# Altium project WFR24_ECU_V1_loc.PrjPcb
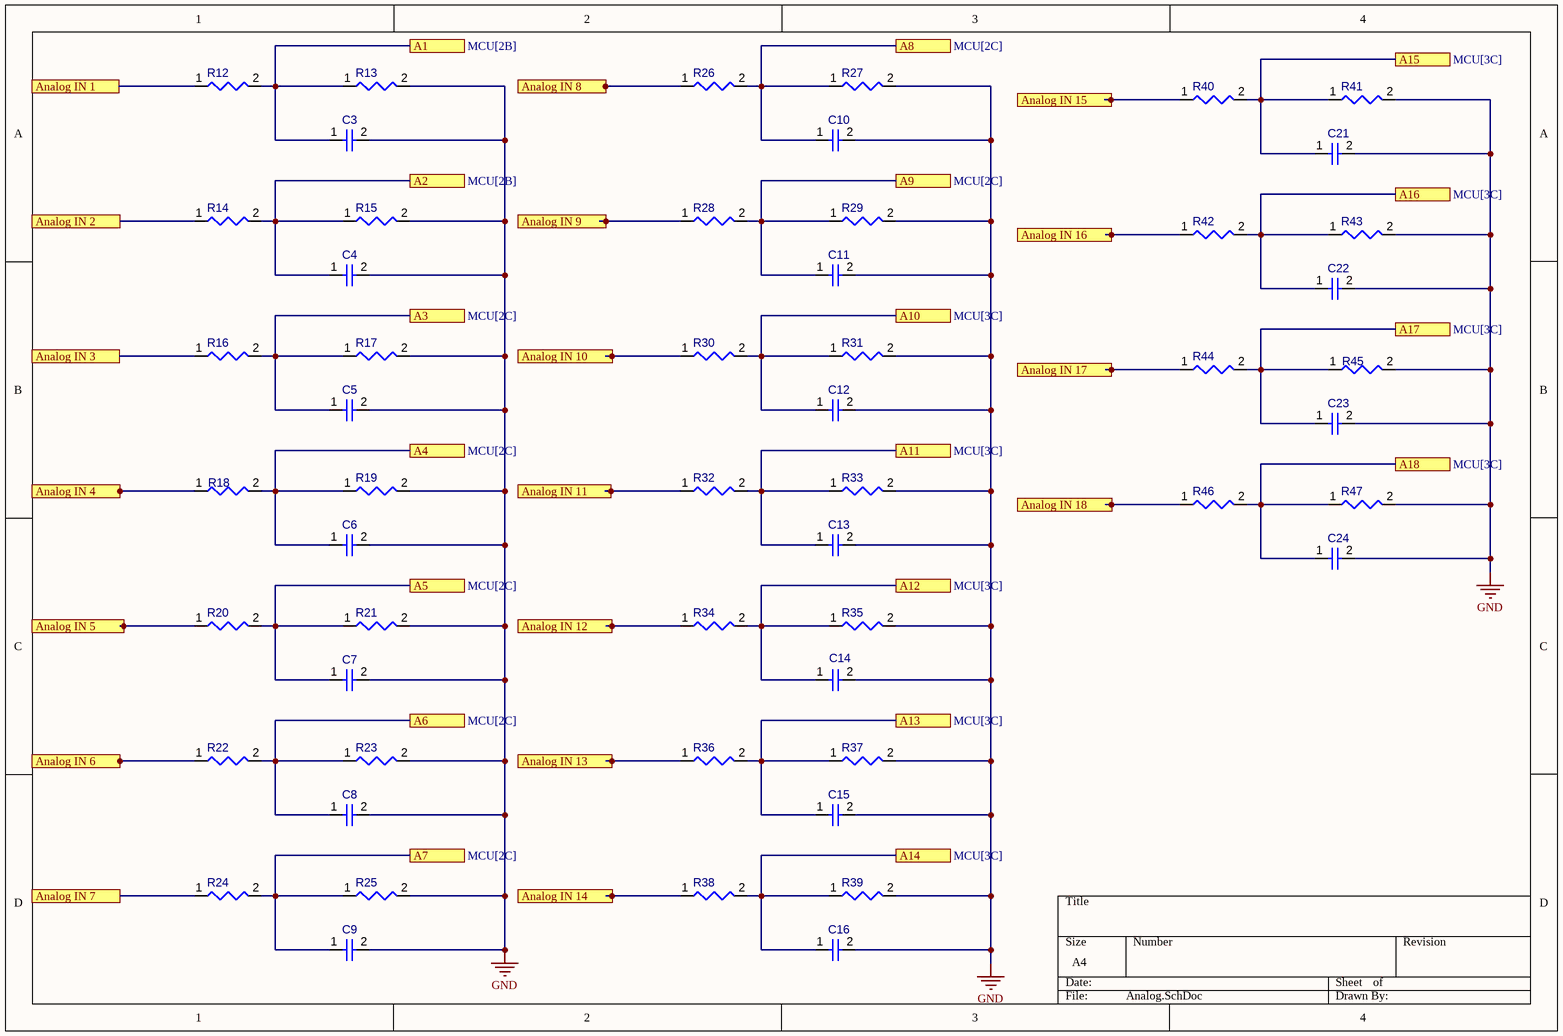
[diagram p0: Analog.SchDoc]
SCH_REV: A; PCB_REV: A; PCB_PART_NUMBER: <PCB PN>; PCB_ENGINEER_APP_DATE: --/--/----; PCB_ENGINEER: - -----; PCB_DWG_NO: <PCB DWG NO>; PCB_DESIGNER_APP_DATE: --/--/----; PCB_DESIGNER: - -----; PCB_CHECKER_APP_DATE: --/--/----; PCB_CHECKER: - -----; PCB_ASSEMBLY_NO: <PCB ASSY NO>; PCB_ANG_TOL: +/-1/2; PCB_3_DEC_TOL: +/-.010; PCB_2_DEC_TOL: +/-.01; DOC_NO_SCH_DWG: <SCH DWG NO>; DOC_NO_FAB_DWG: <FAB DWG NO>; DOC_NO_BOM: <BOM DOC NO>; DOC_NO_ASSY_DWG: <ASSY DWG NO>; CONTRACT_NUMBER: <CONTRACT NO>; CAGE_CODE: ?????
4 sheets, 94 parts. Net scope: flat (ports and power ports of the same name join across sheets).
Board file: PCB1.PcbDoc
Sheets:
  Analog.SchDoc
  DigitalandPWR.SchDoc
  Inputs.SchDoc
  MCU.SchDoc

## Sheet Analog.SchDoc
size A4; SheetNumber: 1; SheetTotal: 5

### Parts
C3  AC0402KRX7R7BB333  [CAPC1005X04N]  (value not drawn)
C4  AC0402KRX7R7BB333  [CAPC1005X04N]  (value not drawn)
C5  AC0402KRX7R7BB333  [CAPC1005X04N]  (value not drawn)
C6  AC0402KRX7R7BB333  [CAPC1005X04N]  (value not drawn)
C7  AC0402KRX7R7BB333  [CAPC1005X04N]  (value not drawn)
C8  AC0402KRX7R7BB333  [CAPC1005X04N]  (value not drawn)
C9  AC0402KRX7R7BB333  [CAPC1005X04N]  (value not drawn)
C10  AC0402KRX7R7BB333  [CAPC1005X04N]  (value not drawn)
C11  AC0402KRX7R7BB333  [CAPC1005X04N]  (value not drawn)
C12  AC0402KRX7R7BB333  [CAPC1005X04N]  (value not drawn)
C13  AC0402KRX7R7BB333  [CAPC1005X04N]  (value not drawn)
C14  AC0402KRX7R7BB333  [CAPC1005X04N]  (value not drawn)
C15  AC0402KRX7R7BB333  [CAPC1005X04N]  (value not drawn)
C16  AC0402KRX7R7BB333  [CAPC1005X04N]  (value not drawn)
C21  AC0402KRX7R7BB333  [CAPC1005X04N]  (value not drawn)
C22  AC0402KRX7R7BB333  [CAPC1005X04N]  (value not drawn)
C23  AC0402KRX7R7BB333  [CAPC1005X04N]  (value not drawn)
C24  AC0402KRX7R7BB333  [CAPC1005X04N]  (value not drawn)
R12  0402WGD2002TCE  [CAPC1005X04N]  (value not drawn)
R13  SY0402DE30KP  [CAPC1005X04N]  (value not drawn)
R14  0402WGD2002TCE  [CAPC1005X04N]  (value not drawn)
R15  SY0402DE30KP  [CAPC1005X04N]  (value not drawn)
R16  0402WGD2002TCE  [CAPC1005X04N]  (value not drawn)
R17  SY0402DE30KP  [CAPC1005X04N]  (value not drawn)
R18  0402WGD2002TCE  [CAPC1005X04N]  (value not drawn)
R19  SY0402DE30KP  [CAPC1005X04N]  (value not drawn)
R20  0402WGD2002TCE  [CAPC1005X04N]  (value not drawn)
R21  SY0402DE30KP  [CAPC1005X04N]  (value not drawn)
R22  0402WGD2002TCE  [CAPC1005X04N]  (value not drawn)
R23  SY0402DE30KP  [CAPC1005X04N]  (value not drawn)
R24  0402WGD2002TCE  [CAPC1005X04N]  (value not drawn)
R25  SY0402DE30KP  [CAPC1005X04N]  (value not drawn)
R26  0402WGD2002TCE  [CAPC1005X04N]  (value not drawn)
R27  SY0402DE30KP  [CAPC1005X04N]  (value not drawn)
R28  0402WGD2002TCE  [CAPC1005X04N]  (value not drawn)
R29  SY0402DE30KP  [CAPC1005X04N]  (value not drawn)
R30  0402WGD2002TCE  [CAPC1005X04N]  (value not drawn)
R31  SY0402DE30KP  [CAPC1005X04N]  (value not drawn)
R32  0402WGD2002TCE  [CAPC1005X04N]  (value not drawn)
R33  SY0402DE30KP  [CAPC1005X04N]  (value not drawn)
R34  0402WGD2002TCE  [CAPC1005X04N]  (value not drawn)
R35  SY0402DE30KP  [CAPC1005X04N]  (value not drawn)
R36  0402WGD2002TCE  [CAPC1005X04N]  (value not drawn)
R37  SY0402DE30KP  [CAPC1005X04N]  (value not drawn)
R38  0402WGD2002TCE  [CAPC1005X04N]  (value not drawn)
R39  SY0402DE30KP  [CAPC1005X04N]  (value not drawn)
R40  0402WGD2002TCE  [CAPC1005X04N]  (value not drawn)
R41  SY0402DE30KP  [CAPC1005X04N]  (value not drawn)
R42  0402WGD2002TCE  [CAPC1005X04N]  (value not drawn)
R43  SY0402DE30KP  [CAPC1005X04N]  (value not drawn)
R44  0402WGD2002TCE  [CAPC1005X04N]  (value not drawn)
R45  SY0402DE30KP  [CAPC1005X04N]  (value not drawn)
R46  0402WGD2002TCE  [CAPC1005X04N]  (value not drawn)
R47  SY0402DE30KP  [CAPC1005X04N]  (value not drawn)

### Ports
A1 (see MCU[2B]), A2 (see MCU[2B]), A3 (see MCU[2C]), A4 (see MCU[2C]), A5 (see MCU[2C]), A6 (see MCU[2C]), A7 (see MCU[2C]), A8 (see MCU[2C]), A9 (see MCU[2C]), A10 (see MCU[3C]), A11 (see MCU[3C]), A12 (see MCU[3C]), A13 (see MCU[3C]), A14 (see MCU[3C]), A15 (see MCU[3C]), A16 (see MCU[3C]), A17 (see MCU[3C]), A18 (see MCU[3C]), Analog IN 1, Analog IN 2, Analog IN 3, Analog IN 4, Analog IN 5, Analog IN 6, Analog IN 7, Analog IN 8, Analog IN 9, Analog IN 10, Analog IN 11, Analog IN 12, Analog IN 13, Analog IN 14, Analog IN 15, Analog IN 16, Analog IN 17, Analog IN 18

### Nets
GND: C3.2 C4.2 C5.2 C6.2 C7.2 C8.2 C9.2 C10.2 C11.2 C12.2 C13.2 C14.2 C15.2 C16.2 C21.2 C22.2 C23.2 C24.2 R13.2 R15.2 R17.2 R19.2 R21.2 R23.2 R25.2 R27.2 R29.2 R31.2 R33.2 R35.2 R37.2 R39.2 R41.2 R43.2 R45.2 R47.2
A1: C3.1 R12.2 R13.1 ; port A1
A2: C4.1 R14.2 R15.1 ; port A2
A3: C5.1 R16.2 R17.1 ; port A3
A4: C6.1 R18.2 R19.1 ; port A4
A5: C7.1 R20.2 R21.1 ; port A5
A6: C8.1 R22.2 R23.1 ; port A6
A7: C9.1 R24.2 R25.1 ; port A7
A8: C10.1 R26.2 R27.1 ; port A8
A9: C11.1 R28.2 R29.1 ; port A9
A10: C12.1 R30.2 R31.1 ; port A10
A11: C13.1 R32.2 R33.1 ; port A11
A12: C14.1 R34.2 R35.1 ; port A12
A13: C15.1 R36.2 R37.1 ; port A13
A14: C16.1 R38.2 R39.1 ; port A14
A15: C21.1 R40.2 R41.1 ; port A15
A16: C22.1 R42.2 R43.1 ; port A16
A17: C23.1 R44.2 R45.1 ; port A17
A18: C24.1 R46.2 R47.1 ; port A18
Analog IN 1: R12.1 ; port Analog IN 1
Analog IN 2: R14.1 ; port Analog IN 2
Analog IN 3: R16.1 ; port Analog IN 3
Analog IN 4: R18.1 ; port Analog IN 4
Analog IN 5: R20.1 ; port Analog IN 5
Analog IN 6: R22.1 ; port Analog IN 6
Analog IN 7: R24.1 ; port Analog IN 7
Analog IN 8: R26.1 ; port Analog IN 8
Analog IN 9: R28.1 ; port Analog IN 9
Analog IN 10: R30.1 ; port Analog IN 10
Analog IN 11: R32.1 ; port Analog IN 11
Analog IN 12: R34.1 ; port Analog IN 12
Analog IN 13: R36.1 ; port Analog IN 13
Analog IN 14: R38.1 ; port Analog IN 14
Analog IN 15: R40.1 ; port Analog IN 15
Analog IN 16: R42.1 ; port Analog IN 16
Analog IN 17: R44.1 ; port Analog IN 17
Analog IN 18: R46.1 ; port Analog IN 18

### Library data of the parts
C3-C16 C21-C24 = CMP-001-00107-1: 33nF capacitor
R12 R14 = CMP-009-00205-1: 20k; Case/Package: 0402
R13 R15 R17 R19 R21 R23 R25 R27 R29 R31 R33 R35 R37 R39 R41 R43 R45 R47 = CMP-009-00206-1: 30k Resistor
R16 R18 R20 R22 R24 R26 R28 R30 R32 R34 R36 R38 R40 R42 R44 R46 = CMP-009-00205-1: Case/Package: 0402

## Sheet DigitalandPWR.SchDoc
size A4; SheetNumber: 2; SheetTotal: 3
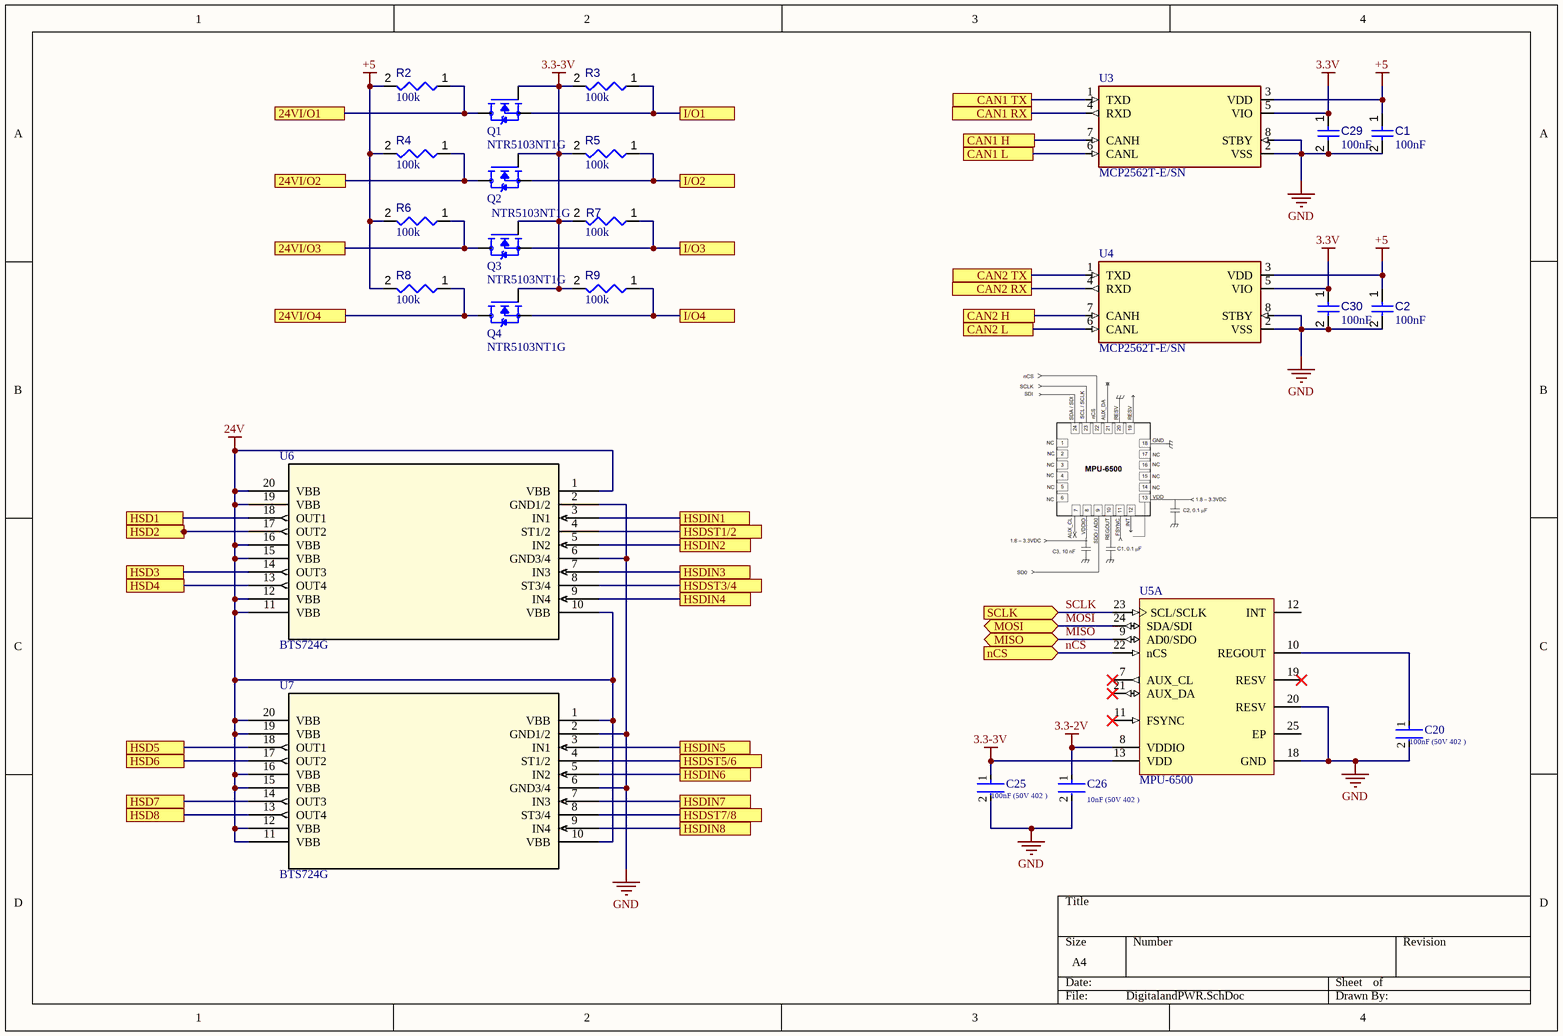
[diagram p1: DigitalandPWR.SchDoc]

### Parts
C1  value 100nF  [CAPC0402(1005)60_L]  (hidden comment: Capacitor 100nF +/-20% 25V 0402)
C2  value 100nF  [CAPC0402(1005)60_L]  (hidden comment: Capacitor 100nF +/-20% 25V 0402)
C20  100nF (50V 402 )  [FP-CL779-IPC_C]
C25  100nF (50V 402 )  [FP-CL779-IPC_C]
C26  10nF (50V 402 )  [FP-CL165-IPC_C]
C29  value 100nF  [CAPC0402(1005)60_L]  (hidden comment: Capacitor 100nF +/-20% 25V 0402)
C30  value 100nF  [CAPC0402(1005)60_L]  (hidden comment: Capacitor 100nF +/-20% 25V 0402)
Q1  NTR5103NT1G  [SOT95P237X111-3N]
Q2  NTR5103NT1G  [SOT95P237X111-3N]
Q3  NTR5103NT1G  [SOT95P237X111-3N]
Q4  NTR5103NT1G  [SOT95P237X111-3N]
R2  value 100k  [RESC0402(1005)_L]  (hidden comment: Resistor 100K +/-1 % 0402 63 mW)
R3  value 100k  [RESC0402(1005)_L]  (hidden comment: Resistor 100K +/-1 % 0402 63 mW)
R4  value 100k  [RESC0402(1005)_L]  (hidden comment: Resistor 100K +/-1 % 0402 63 mW)
R5  value 100k  [RESC0402(1005)_L]  (hidden comment: Resistor 100K +/-1 % 0402 63 mW)
R6  value 100k  [RESC0402(1005)_L]  (hidden comment: Resistor 100K +/-1 % 0402 63 mW)
R7  value 100k  [RESC0402(1005)_L]  (hidden comment: Resistor 100K +/-1 % 0402 63 mW)
R8  value 100k  [RESC0402(1005)_L]  (hidden comment: Resistor 100K +/-1 % 0402 63 mW)
R9  value 100k  [RESC0402(1005)_L]  (hidden comment: Resistor 100K +/-1 % 0402 63 mW)
U3  MCP2562T-E/SN  [SOIC127P600X175-8N]
U4  MCP2562T-E/SN  [SOIC127P600X175-8N]
U5  MPU-6500  [INSE-MPU-6500-QFN24_M]  (part A of 2)
U6  BTS724G  [SOIC-20_INF]
U7  BTS724G  [SOIC-20_INF]

### Ports
24VI/O1, 24VI/O2, 24VI/O3, 24VI/O4, CAN1 H, CAN1 L, CAN1 RX, CAN1 TX, CAN2 H, CAN2 L, CAN2 RX, CAN2 TX, HSD1, HSD2, HSD3, HSD4, HSD5, HSD6, HSD7, HSD8, HSDIN1, HSDIN2, HSDIN3, HSDIN4, HSDIN5, HSDIN6, HSDIN7, HSDIN8, HSDST1/2, HSDST3/4, HSDST5/6, HSDST7/8, I/O1, I/O2, I/O3, I/O4, MISO (bidir), MOSI (bidir), nCS (in), SCLK (in)

### Nets
3.3-2V: C26.1 U5.8(VDDIO)
3.3-3V: C25.1 Q1.1(G) Q2.1(G) Q3.1(G) Q4.1(G) R3.2 R5.2 R7.2 R9.2 U5.13(VDD)
3.3V: C29.1 C30.1 U3.5(VIO) U4.5(VIO)
24V: U6.1(VBB) U6.10(VBB) U6.11(VBB) U6.12(VBB) U6.15(VBB) U6.16(VBB) U6.19(VBB) U6.20(VBB) U7.1(VBB) U7.10(VBB) U7.11(VBB) U7.12(VBB) U7.15(VBB) U7.16(VBB) U7.19(VBB) U7.20(VBB)
+5: C1.1 C2.1 R2.2 R4.2 R6.2 R8.2 U3.3(VDD) U4.3(VDD)
GND: C1.2 C2.2 C20.2 C25.2 C26.2 C29.2 C30.2 U3.2(VSS) U3.8(STBY) U4.2(VSS) U4.8(STBY) U5.18(GND) U5.20(RESV) U6.2(GND1/2) U6.6(GND3/4) U7.2(GND1/2) U7.6(GND3/4)
24VI/O1: Q1.3(D) R2.1 ; port 24VI/O1
24VI/O2: Q2.3(D) R4.1 ; port 24VI/O2
24VI/O3: Q3.3(D) R6.1 ; port 24VI/O3
24VI/O4: Q4.3(D) R8.1 ; port 24VI/O4
CAN1 H: U3.7(CANH) ; port CAN1 H
CAN1 L: U3.6(CANL) ; port CAN1 L
CAN1 RX: U3.4(RXD) ; port CAN1 RX
CAN1 TX: U3.1(TXD) ; port CAN1 TX
CAN2 H: U4.7(CANH) ; port CAN2 H
CAN2 L: U4.6(CANL) ; port CAN2 L
CAN2 RX: U4.4(RXD) ; port CAN2 RX
CAN2 TX: U4.1(TXD) ; port CAN2 TX
HSD1: U6.18(OUT1) ; port HSD1
HSD2: U6.17(OUT2) ; port HSD2
HSD3: U6.14(OUT3) ; port HSD3
HSD4: U6.13(OUT4) ; port HSD4
HSD5: U7.18(OUT1) ; port HSD5
HSD6: U7.17(OUT2) ; port HSD6
HSD7: U7.14(OUT3) ; port HSD7
HSD8: U7.13(OUT4) ; port HSD8
HSDIN1: U6.3(IN1) ; port HSDIN1
HSDIN2: U6.5(IN2) ; port HSDIN2
HSDIN3: U6.7(IN3) ; port HSDIN3
HSDIN4: U6.9(IN4) ; port HSDIN4
HSDIN5: U7.3(IN1) ; port HSDIN5
HSDIN6: U7.5(IN2) ; port HSDIN6
HSDIN7: U7.7(IN3) ; port HSDIN7
HSDIN8: U7.9(IN4) ; port HSDIN8
HSDST1/2: U6.4(ST1/2) ; port HSDST1/2
HSDST3/4: U6.8(ST3/4) ; port HSDST3/4
HSDST5/6: U7.4(ST1/2) ; port HSDST5/6
HSDST7/8: U7.8(ST3/4) ; port HSDST7/8
I/O1: Q1.2(S) R3.1 ; port I/O1
I/O2: Q2.2(S) R5.1 ; port I/O2
I/O3: Q3.2(S) R7.1 ; port I/O3
I/O4: Q4.2(S) R9.1 ; port I/O4
MISO: U5.9(AD0/SDO) ; port MISO
MOSI: U5.24(SDA/SDI) ; port MOSI
nCS: U5.22(nCS) ; port nCS
SCLK: U5.23(SCL/SCLK) ; port SCLK
NetC20_1: C20.1 U5.10(REGOUT)

Not connected (* = marked no-connect by the designer): U5 7(AUX_CL)* 11(FSYNC)* 12(INT) 19(RESV)* 21(AUX_DA)* 25(EP)

### Library data of the parts
C1 C2 C29 C30 = CMP-001-00065-4: Chip Capacitor, 100nF +/-20%, 25V, 0402, Thickness 0.6 mm; Tolerance: 10%; Max Operating Temperature: 85°C; Min Operating Temperature: -55°C; Pins: 2; Voltage Rating: 25V; Mounting Technology: SMT; Case/Package: 0402
C20 C25 = CMP-13271-002336-1: Cap Ceramic 100nF 50V X7R ±10% SMD 0402 +125°C Paper T/R
C26 = CMP-13271-000387-1: Cap Ceramic 10nF 50V X7R ±10% SMD 0402 +125°C Paper T/R; Depth: 0.5mm; Length: 1mm; Lead Free: Lead Free; Case Code (Metric): 1005; Width: 0.02inch; Min Operating Temperature: -55°C; Thickness: 0.022inch; Package Quantity: 1; Mount: Surface Mount; Height: 0.5mm; Voltage: 50V; Material: Ceramic; Tolerance: 10%; Case Code (Imperial): 0402; Radiation Hardening: No; Case/Package: 0402; Max Operating Temperature: 125°C; Voltage Rating (DC): 50V; Contact Plating: Tin; Packaging: Tape and Reel; Voltage Rating: 50V; Capacitance: 10nF; Dielectric: X7R
Q1-Q4 = CMP-017-000000-1: N-Channel 60V 260mA _Ta_ 300mW _Ta_ Surface Mount SOT-23-3 _TO-236_; MF: ON Semiconductor; Availability: Unavailable; MP: NTR5103NT1G; Source: SnapEDAsch.SchLib; Price: None; Component Type: Standard; Design Item ID: NTR5103NT1G; SnapEDA_Link: https://www.snapeda.com/parts/NTR5103NT1G/ON%20Semiconductor/view-part/565803/?ref=snap; Value: *; Pin Count: 3; Package: SOT-23 ON Semiconductor
R2-R9 = CMP-009-00168-3: Chip Resistor, 100 kOhms, +/-1 %, 63 mW, -55 to 155 degC, 0402; Tolerance: 1%; Power: 63mW; Max Operating Temperature: 155°C; Min Operating Temperature: -55°C; Pins: 2; Case/Package: 0402
U3 U4 = CMP-229-000000-1: 1/1 Transceiver Half CANbus 8-SOIC; MF: Microchip; Digi-Key_Part_Number: MCP2562T-E/SNCT-ND; Pin Count: 8; Source: SnapEDAsch.SchLib; Package: SO-8 Microchip; Value: *; Component Type: Standard; SnapEDA_Link: https://www.snapeda.com/parts/MCP2562T-E/SN/Microchip/view-part/554377/?ref=snap; Design Item ID: MCP2562T-E/SN; Digi-Key_Purchase_URL: https://www.digikey.com/product-detail/en/microchip-technology/MCP2562T-E-SN/MCP2562T-E-SNCT-ND/5011025?utm_source=snapeda&utm_medium=aggregator&utm_campaign=symbol; MP: MCP2562T-E/SN
U5 = CMP-2000-05154-1: 3-Axis Gyroscope and 3-Axis Accelerometer Motion Processing Unit with I2C and SPI, 1.71 to 3.45 V, -40 to 85 degC, 24-Pin QFN, RoHS, Tape and Reel; Manufacturer: InvenSense; Online Catalog: MPU-6500Series; Output Type: Digital; Sensor Type: GyroscopeandAccelerometer; Featured Product: InvenSense-MPU-6500Six-Axis(Gyro+Acceleromete)MEMSMotionTrackingDevices; Other Names: 1428-1011-6; Article Library: MCUsasSensorHubs; Series: -; Category: Sensors,Transducers; Dynamic Catalog: MPU-6500Series; Standard Package: 1; Manufacturer URL: http://www.invensense.com/; Family: Multifunction; Datasheet Version: Rev. 1.0, 09/2013; Datasheet URL: https://datasheet.ciiva.com/29175/mpu-6500-spec-29175093.pdf
U6 U7 = CMP-201-000000-1: No Description Available; Mfr_Name: Infineon; Design Item ID: BTS724G; Source: BTS724G.SchLib; Type: DEV; RefDes: RefDes; Manufacturer_Part_Number: BTS724G; Copyright: Copyright (C) 2023 Ultra Librarian. All rights reserved.

## Sheet Inputs.SchDoc
size A4; SheetNumber: 3; SheetTotal: 4
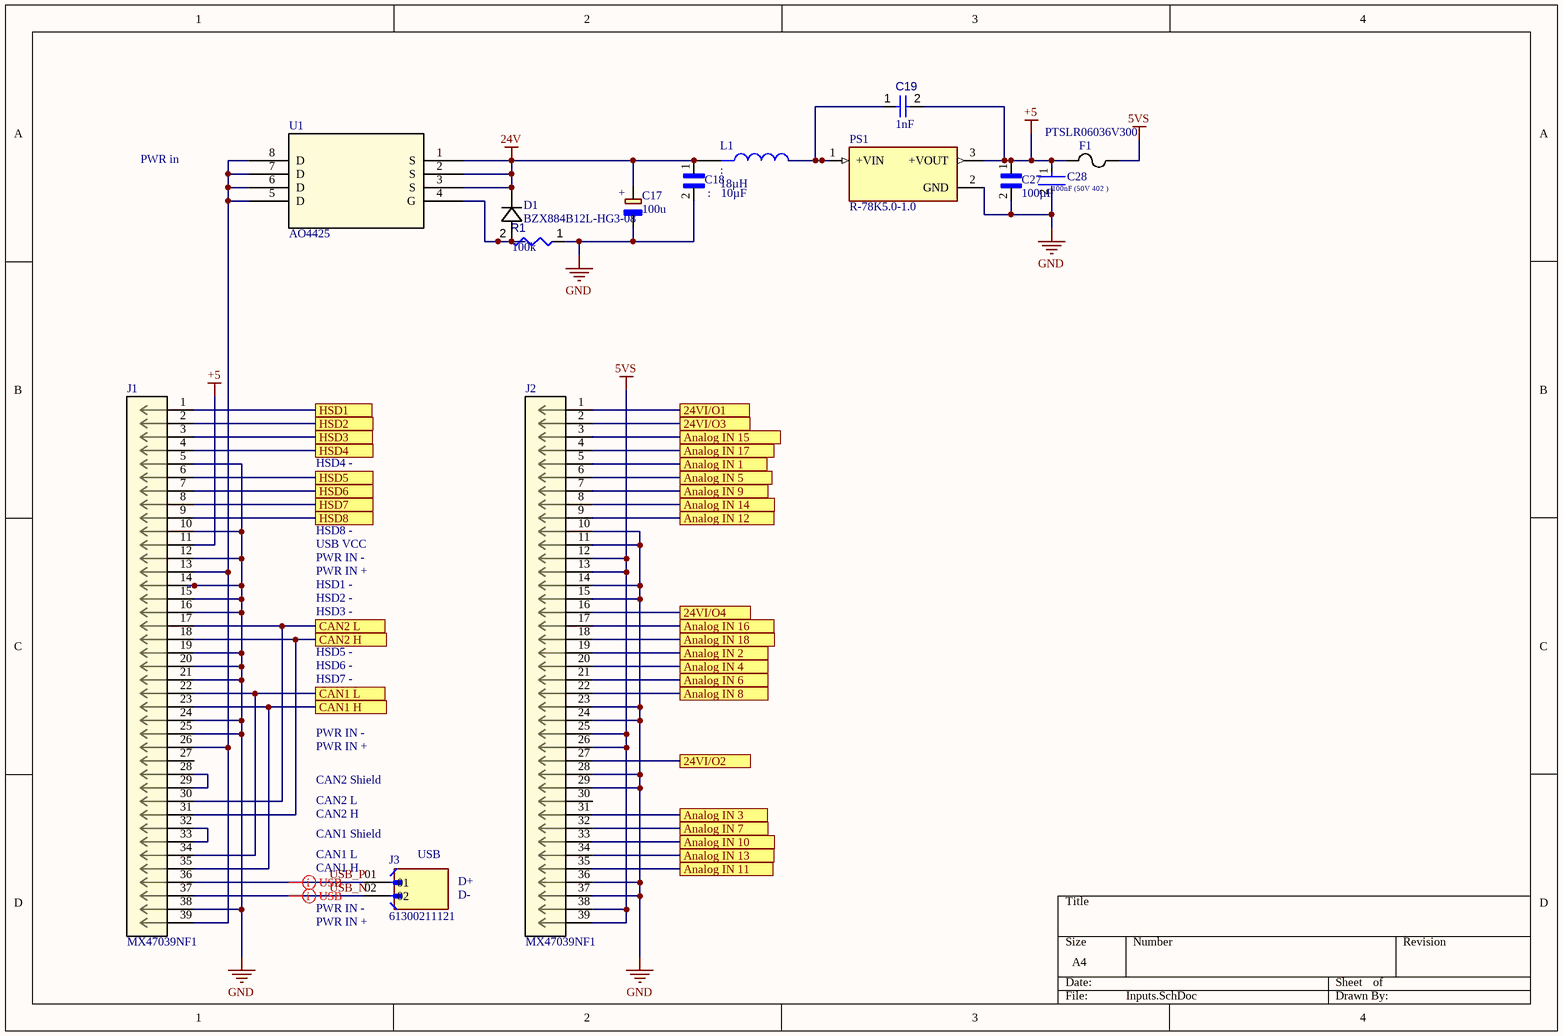
[diagram p2: Inputs.SchDoc]

### Parts
C17  value 100u  [865080445010]  (hidden comment: 865080545012)
C18  value 10µF  [CAPC2012X145N]  (hidden comment: GRM21BR61H106KE43L)
C19  value 1nF  [CAPC0402(1005)33_L]  (hidden comment: Capacitor 1nF +/-20% 50V 0402)
C27  value 100µF  [CAPC3216X190N]  (hidden comment: GRM31CR61A107MEA8L)
C28  100nF (50V 402 )  [FP-CL779-IPC_C]
D1  BZX884B12L-HG3-08  [CR_9V1L-HG3-08_VIS]
F1  PTSLR06036V300  [FUSE_PTSLR06036V300_EAT]
J1  MX47039NF1  [CONN39_MX47039_JAE]
J2  MX47039NF1  [CONN39_MX47039_JAE]
J3  61300211121  [WURTH_61300211121]
L1  value 18µH  [IND_RLS-186]  (hidden comment: RLS-186)
PS1  R-78K5.0-1.0  [CONV_R-78K5.0-1.0]
R1  value 100k  [RESC0402(1005)_L]  (hidden comment: Resistor 100K +/-1 % 0402 63 mW)
U1  AO4425  [SO-8_AOS]

### Ports
24VI/O1, 24VI/O2, 24VI/O3, 24VI/O4, Analog IN 1, Analog IN 2, Analog IN 3, Analog IN 4, Analog IN 5, Analog IN 6, Analog IN 7, Analog IN 8, Analog IN 9, Analog IN 10, Analog IN 11, Analog IN 12, Analog IN 13, Analog IN 14, Analog IN 15, Analog IN 16, Analog IN 17, Analog IN 18, CAN1 H, CAN1 L, CAN2 H, CAN2 L, HSD1, HSD2, HSD3, HSD4, HSD5, HSD6, HSD7, HSD8

### Nets
5VS: F1.2 J2.12 J2.13 J2.25 J2.26 J2.38 J2.39
24V: C17.POS C18.1 D1.1 L1.1 U1.1(S) U1.2(S) U1.3(S)
+5: C19.2 C27.1 C28.1 F1.1 J1.11 PS1.3(+VOUT)
GND: C17.NEG C18.2 C27.2 C28.2 J1.5 J1.10 J1.12 J1.14 J1.15 J1.16 J1.19 J1.20 J1.21 J1.24 J1.25 J1.38 J2.10 J2.11 J2.14 J2.15 J2.23 J2.24 J2.28 J2.29 J2.36 J2.37 PS1.2(GND) R1.1
24VI/O1: J2.1 ; port 24VI/O1
24VI/O2: J2.27 ; port 24VI/O2
24VI/O3: J2.2 ; port 24VI/O3
24VI/O4: J2.16 ; port 24VI/O4
Analog IN 1: J2.5 ; port Analog IN 1
Analog IN 2: J2.19 ; port Analog IN 2
Analog IN 3: J2.31 ; port Analog IN 3
Analog IN 4: J2.20 ; port Analog IN 4
Analog IN 5: J2.6 ; port Analog IN 5
Analog IN 6: J2.21 ; port Analog IN 6
Analog IN 7: J2.32 ; port Analog IN 7
Analog IN 8: J2.22 ; port Analog IN 8
Analog IN 9: J2.7 ; port Analog IN 9
Analog IN 10: J2.33 ; port Analog IN 10
Analog IN 11: J2.35 ; port Analog IN 11
Analog IN 12: J2.9 ; port Analog IN 12
Analog IN 13: J2.34 ; port Analog IN 13
Analog IN 14: J2.8 ; port Analog IN 14
Analog IN 15: J2.3 ; port Analog IN 15
Analog IN 16: J2.17 ; port Analog IN 16
Analog IN 17: J2.4 ; port Analog IN 17
Analog IN 18: J2.18 ; port Analog IN 18
CAN1 H: J1.23 J1.35 ; port CAN1 H
CAN1 L: J1.22 J1.34 ; port CAN1 L
CAN2 H: J1.18 J1.31 ; port CAN2 H
CAN2 L: J1.17 J1.30 ; port CAN2 L
HSD1: J1.1 ; port HSD1
HSD2: J1.2 ; port HSD2
HSD3: J1.3 ; port HSD3
HSD4: J1.4 ; port HSD4
HSD5: J1.6 ; port HSD5
HSD6: J1.7 ; port HSD6
HSD7: J1.8 ; port HSD7
HSD8: J1.9 ; port HSD8
USB_N: J1.37 J3.02
USB_P: J1.36 J3.01
NetC19_1: C19.1 L1.2 PS1.1(+VIN)
NetD1_2: D1.2 R1.2 U1.4(G)
NetJ1_13: J1.13 J1.26 J1.39 U1.5(D) U1.6(D) U1.7(D) U1.8(D)
NetJ1_28: J1.28 J1.29
NetJ1_32: J1.32 J1.33

Not connected (* = marked no-connect by the designer): J1 27; J2 30

### Layout directives
differential pair: USB_P
differential pair; rule Clearance Constraint [Generic clearance = 10mil, and 12 value(s) for objects]; rule Width Constraint [Pref Width = 10mil    Min Width = 10mil    Max Width = 10mil]: USB_N

### Notes on the sheet
- PWR in
- HSD4 -
- HSD8 -
- USB VCC
- PWR IN +
- PWR IN -
- HSD1 -
- HSD3 -
- HSD5 -
- HSD2 -
- HSD7 -
- HSD6 -
- CAN2 Shield
- (near J3) CAN1 Shield
- CAN2 L
- CAN2 H
- (near J3) PWR IN -
- (near J3) PWR IN +
- (near J3) CAN1 L
- (near J3) CAN1 H
- (near J3) USB
- D+
- D-
- (in symbol CMP-174-000000-1) +

### Library data of the parts
C17 = CMP-174-000000-1: 100 ÂµF 35 V Aluminum Electrolytic Capacitors Radial, Can - SMD - 2000 Hrs @ 105Â°C; MF: WÃ¼rth Elektronik; Source: 865080545012.SchLib; Pin Count: 2; Purchase-URL: https://pricing.snapeda.com/search/part/865080545012/?ref=eda; Check_prices: https://www.snapeda.com/parts/865080545012/Wurth+Elektronik/view-part/?ref=eda; SnapEDA_Link: https://www.snapeda.com/parts/865080545012/Wurth+Elektronik/view-part/?ref=snap; Price: None; Design Item ID: 865080545012; Package: Radial WÃ¼rth Elektronik; Availability: In Stock; MP: 865080545012; Component Type: Standard
C18 = CMP-001-00102-1: SMD capacitor X5R(EIA) with capacitance 10uF Tol.10%. Rated voltage 50Vdc 85C; MF: Murata Electronics; SnapEDA_Link: https://www.snapeda.com/parts/GRM21BR61H106KE43L/Murata/view-part/4467420/?ref=snap; MP: GRM21BR61H106KE43L; Mouser-Purchase-URL: https://snapeda.com/shop?store=Mouser&id=4467420; Availability: Warning; Pins: 2; DigiKey-Purchase-URL: https://snapeda.com/shop?store=DigiKey&id=4467420; Price: None; Design Item ID: GRM21BR61H106KE43L; Case/Package: 2012 Murata; Source: GRM21BR61H106KE43L.SchLib; Component Type: Standard
C19 = CMP-001-00066-3: Chip Capacitor, 1nF +/-20%, 50V, 0402, Thickness 0.33 mm; Tolerance: 10%; Case/Package: 0402; Pins: 2; Min Operating Temperature: -55°C; Max Operating Temperature: 85°C; Voltage Rating: 50V; Mounting Technology: SMT
C27 = CMP-001-00109-1: Source: GRM31CR61A107MEA8L.SchLib; Price: None; Availability: Unavailable; Design Item ID: GRM31CR61A107MEA8L; Component Type: Standard; Pins: 2; Case/Package: None; MP: GRM31CR61A107MEA8L
C28 = CMP-13271-002336-1: as C20 on sheet DigitalandPWR
D1 = CMP-122-000001-1: No Description Available; Mfr_Name: Vishay; Type: DEV; Design Item ID: BZX884B12L-HG3-08; RefDes: RefDes; Manufacturer_Part_Number: BZX884B12L-HG3-08; Source: BZX884B12L-HG3-08.SchLib; Copyright: Copyright (C) 2023 Ultra Librarian. All rights reserved.
F1 = CMP-005-00022-2: No Description Available; Mfr_Name: Eaton; Type: DEV; Design Item ID: PTSLR06036V300; Copyright: Copyright (C) 2023 Ultra Librarian. All rights reserved.; Source: PTSLR06036V300.SchLib; RefDes: RefDes; Manufacturer_Part_Number: PTSLR06036V300
J1 J2 = CMP-208-000000-6: No Description Available; Mfr_Name: JAE Electronics; Source: MX47039NF1.SchLib; Copyright: Copyright (C) 2023 Ultra Librarian. All rights reserved.; Type: DEV; Design Item ID: MX47039NF1; RefDes: RefDes; Manufacturer_Part_Number: MX47039NF1
J3 = CMP-002-00083-1: Connector Header Through Hole 2 position 0.100 (2.54mm); MF: Wurth Electronics; Pins: 2; Case/Package: None; Component Type: Standard; Source: 61300211121.SchLib; Design Item ID: 61300211121; SnapEDA_Link: https://www.snapeda.com/parts/61300211121/Wurth+Electronics+Inc./view-part/?ref=snap; MP: 61300211121; Check_prices: https://www.snapeda.com/parts/61300211121/Wurth+Electronics+Inc./view-part/?ref=eda; Value: *
L1 = CMP-006-00026-1: Line Inductors for RECOM Power Supply; Price: None; Pins: 2; MP: RLS-186; Design Item ID: RLS-186; Mouser-Purchase-URL: https://snapeda.com/shop?store=Mouser&id=3641538; SnapEDA_Link: https://www.snapeda.com/parts/RLS-186/Recom%20Power/view-part/3641538/?ref=snap; Arrow_Electronics-Purchase-URL: https://snapeda.com/shop?store=Arrow+Electronics&id=3641538; Case/Package: Nonstandard Recom Power; Component Type: Standard; Availability: Bad; MF: Recom Power; DigiKey-Purchase-URL: https://snapeda.com/shop?store=DigiKey&id=3641538; Source: RLS-186.SchLib
PS1 = CMP-009-00200-1: 1A DC/DC-Converter 'INNOLINE' SIP3 reg; Value: 5; MF: Recom Power; Purchase-URL: https://pricing.snapeda.com/search/part/R-78K5.0-1.0/?ref=eda; Price: None; Source: R-78K5.0-1.0.SchLib; Design Item ID: R-78K5.0-1.0; SnapEDA_Link: https://www.snapeda.com/parts/R-78K5.0-1.0/Recom+Power/view-part/?ref=snap; Pins: 3; MP: R-78K5.0-1.0; Availability: In Stock; Case/Package: None; Check_prices: https://www.snapeda.com/parts/R-78K5.0-1.0/Recom+Power/view-part/?ref=eda; Component Type: Standard
R1 = CMP-009-00168-3: as R2 on sheet DigitalandPWR; Max Operating Temperature: 155°C; Min Operating Temperature: -55°C; Pins: 2; Case/Package: 0402
U1 = CMP-119-000000-1: No Description Available; Mfr_Name: Alpha and Omega Semiconductor; Design Item ID: AO4425; RefDes: RefDes; Type: DEV; Manufacturer_Part_Number: AO4425; Copyright: Copyright (C) 2023 Ultra Librarian. All rights reserved.; Source: AO4286.SchLib

## Sheet MCU.SchDoc
size A4; SheetNumber: 4; SheetTotal: 4
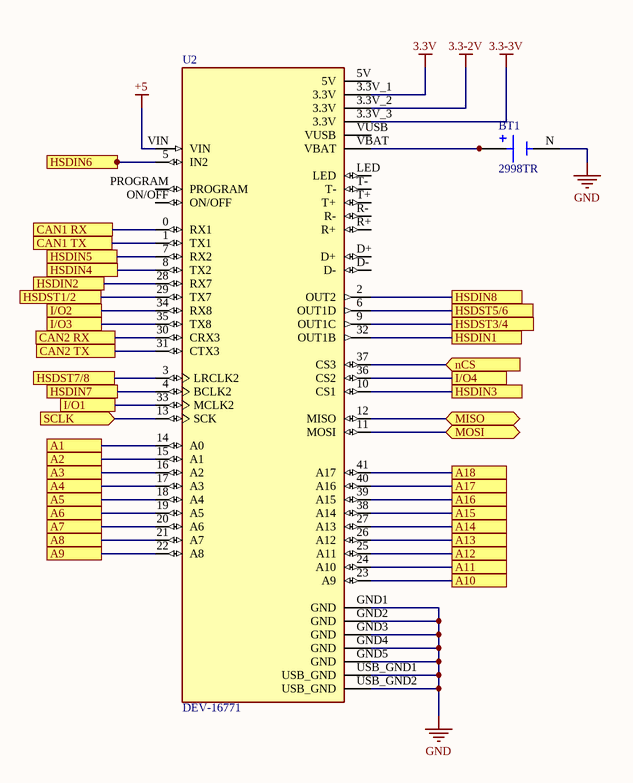
[diagram p3: MCU.SchDoc]

### Parts
BT1  2998TR  [BAT_2998TR]
U2  DEV-16771  [MODULE_DEV-16771]

### Ports
A1, A2, A3, A4, A5, A6, A7, A8, A9, A10, A11, A12, A13, A14, A15, A16, A17, A18, CAN1 RX, CAN1 TX, CAN2 RX, CAN2 TX, HSDIN1, HSDIN2, HSDIN3, HSDIN4, HSDIN5, HSDIN6, HSDIN7, HSDIN8, HSDST1/2, HSDST3/4, HSDST5/6, HSDST7/8, I/O1, I/O2, I/O3, I/O4, MISO (bidir), MOSI (bidir), nCS (in), SCLK (in)

### Nets
3.3-2V: U2.3.3V_2(3.3V)
3.3-3V: U2.3.3V_3(3.3V)
3.3V: U2.3.3V_1(3.3V)
+5: U2.VIN
GND: BT1.N(NEG) U2.GND1(GND) U2.GND2(GND) U2.GND3(GND) U2.GND4(GND) U2.GND5(GND) U2.USB_GND1(USB_GND) U2.USB_GND2(USB_GND)
A1: U2.14(A0) ; port A1
A2: U2.15(A1) ; port A2
A3: U2.16(A2) ; port A3
A4: U2.17(A3) ; port A4
A5: U2.18(A4) ; port A5
A6: U2.19(A5) ; port A6
A7: U2.20(A6) ; port A7
A8: U2.21(A7) ; port A8
A9: U2.22(A8) ; port A9
A10: U2.23(A9) ; port A10
A11: U2.24(A10) ; port A11
A12: U2.25(A11) ; port A12
A13: U2.26(A12) ; port A13
A14: U2.27(A13) ; port A14
A15: U2.38(A14) ; port A15
A16: U2.39(A15) ; port A16
A17: U2.40(A16) ; port A17
A18: U2.41(A17) ; port A18
CAN1 RX: U2.0(RX1) ; port CAN1 RX
CAN1 TX: U2.1(TX1) ; port CAN1 TX
CAN2 RX: U2.30(CRX3) ; port CAN2 RX
CAN2 TX: U2.31(CTX3) ; port CAN2 TX
HSDIN1: U2.32(OUT1B) ; port HSDIN1
HSDIN2: U2.28(RX7) ; port HSDIN2
HSDIN3: U2.10(CS1) ; port HSDIN3
HSDIN4: U2.8(TX2) ; port HSDIN4
HSDIN5: U2.7(RX2) ; port HSDIN5
HSDIN6: U2.5(IN2) ; port HSDIN6
HSDIN7: U2.4(BCLK2) ; port HSDIN7
HSDIN8: U2.2(OUT2) ; port HSDIN8
HSDST1/2: U2.29(TX7) ; port HSDST1/2
HSDST3/4: U2.9(OUT1C) ; port HSDST3/4
HSDST5/6: U2.6(OUT1D) ; port HSDST5/6
HSDST7/8: U2.3(LRCLK2) ; port HSDST7/8
I/O1: U2.33(MCLK2) ; port I/O1
I/O2: U2.34(RX8) ; port I/O2
I/O3: U2.35(TX8) ; port I/O3
I/O4: U2.36(CS2) ; port I/O4
MISO: U2.12(MISO) ; port MISO
MOSI: U2.11(MOSI) ; port MOSI
nCS: U2.37(CS3) ; port nCS
SCLK: U2.13(SCK) ; port SCLK
NetBT1_P1: BT1.P1(POS) BT1.P2(POS) U2.VBAT

Not connected (* = marked no-connect by the designer): U2 5V D+ D- LED ON/OFF PROGRAM R+ R- T+ T- VUSB

### Library data of the parts
BT1 = CMP-240-000000-1: Availability: Unavailable; Component Type: Standard; MP: 2998TR; Value: *; Pin Count: 3; Design Item ID: 2998TR; Source: 2998TR.SchLib; Price: None; Package: None
U2 = CMP-160-000000-1: RT1062 Teensy 4.1 series ARMÂ® CortexÂ®-M7 MPU Embedded Evaluation Board; MF: SparkFun Electronics; Source: DEV-16771.SchLib; Pin Count: 65; Purchase-URL: https://pricing.snapeda.com/search/part/DEV-16771/?ref=eda; SnapEDA_Link: https://www.snapeda.com/parts/DEV-16771/SparkFun+Electronics/view-part/?ref=snap; Design Item ID: DEV-16771; Package: None; Check_prices: https://www.snapeda.com/parts/DEV-16771/SparkFun+Electronics/view-part/?ref=eda; Availability: In Stock; Component Type: Standard; MP: DEV-16771; Price: None; Value: *

## Nets that join several sheets
3.3-2V: DigitalandPWR (C26.1 U5.8), MCU (U2.3.3V_2)
3.3-3V: DigitalandPWR (10 pins), MCU (U2.3.3V_3)
3.3V: DigitalandPWR (C29.1 C30.1 U3.5 U4.5), MCU (U2.3.3V_1)
24V: DigitalandPWR (16 pins), Inputs (7 pins)
+5: DigitalandPWR (8 pins), Inputs (6 pins), MCU (U2.VIN)
GND: Analog (36 pins), DigitalandPWR (17 pins), Inputs (28 pins), MCU (8 pins)
24VI/O1: DigitalandPWR (Q1.3 R2.1), Inputs (J2.1)
24VI/O2: DigitalandPWR (Q2.3 R4.1), Inputs (J2.27)
24VI/O3: DigitalandPWR (Q3.3 R6.1), Inputs (J2.2)
24VI/O4: DigitalandPWR (Q4.3 R8.1), Inputs (J2.16)
A1: Analog (C3.1 R12.2 R13.1), MCU (U2.14)
A2: Analog (C4.1 R14.2 R15.1), MCU (U2.15)
A3: Analog (C5.1 R16.2 R17.1), MCU (U2.16)
A4: Analog (C6.1 R18.2 R19.1), MCU (U2.17)
A5: Analog (C7.1 R20.2 R21.1), MCU (U2.18)
A6: Analog (C8.1 R22.2 R23.1), MCU (U2.19)
A7: Analog (C9.1 R24.2 R25.1), MCU (U2.20)
A8: Analog (C10.1 R26.2 R27.1), MCU (U2.21)
A9: Analog (C11.1 R28.2 R29.1), MCU (U2.22)
A10: Analog (C12.1 R30.2 R31.1), MCU (U2.23)
A11: Analog (C13.1 R32.2 R33.1), MCU (U2.24)
A12: Analog (C14.1 R34.2 R35.1), MCU (U2.25)
A13: Analog (C15.1 R36.2 R37.1), MCU (U2.26)
A14: Analog (C16.1 R38.2 R39.1), MCU (U2.27)
A15: Analog (C21.1 R40.2 R41.1), MCU (U2.38)
A16: Analog (C22.1 R42.2 R43.1), MCU (U2.39)
A17: Analog (C23.1 R44.2 R45.1), MCU (U2.40)
A18: Analog (C24.1 R46.2 R47.1), MCU (U2.41)
Analog IN 1: Analog (R12.1), Inputs (J2.5)
Analog IN 2: Analog (R14.1), Inputs (J2.19)
Analog IN 3: Analog (R16.1), Inputs (J2.31)
Analog IN 4: Analog (R18.1), Inputs (J2.20)
Analog IN 5: Analog (R20.1), Inputs (J2.6)
Analog IN 6: Analog (R22.1), Inputs (J2.21)
Analog IN 7: Analog (R24.1), Inputs (J2.32)
Analog IN 8: Analog (R26.1), Inputs (J2.22)
Analog IN 9: Analog (R28.1), Inputs (J2.7)
Analog IN 10: Analog (R30.1), Inputs (J2.33)
Analog IN 11: Analog (R32.1), Inputs (J2.35)
Analog IN 12: Analog (R34.1), Inputs (J2.9)
Analog IN 13: Analog (R36.1), Inputs (J2.34)
Analog IN 14: Analog (R38.1), Inputs (J2.8)
Analog IN 15: Analog (R40.1), Inputs (J2.3)
Analog IN 16: Analog (R42.1), Inputs (J2.17)
Analog IN 17: Analog (R44.1), Inputs (J2.4)
Analog IN 18: Analog (R46.1), Inputs (J2.18)
CAN1 H: DigitalandPWR (U3.7), Inputs (J1.23 J1.35)
CAN1 L: DigitalandPWR (U3.6), Inputs (J1.22 J1.34)
CAN1 RX: DigitalandPWR (U3.4), MCU (U2.0)
CAN1 TX: DigitalandPWR (U3.1), MCU (U2.1)
CAN2 H: DigitalandPWR (U4.7), Inputs (J1.18 J1.31)
CAN2 L: DigitalandPWR (U4.6), Inputs (J1.17 J1.30)
CAN2 RX: DigitalandPWR (U4.4), MCU (U2.30)
CAN2 TX: DigitalandPWR (U4.1), MCU (U2.31)
HSD1: DigitalandPWR (U6.18), Inputs (J1.1)
HSD2: DigitalandPWR (U6.17), Inputs (J1.2)
HSD3: DigitalandPWR (U6.14), Inputs (J1.3)
HSD4: DigitalandPWR (U6.13), Inputs (J1.4)
HSD5: DigitalandPWR (U7.18), Inputs (J1.6)
HSD6: DigitalandPWR (U7.17), Inputs (J1.7)
HSD7: DigitalandPWR (U7.14), Inputs (J1.8)
HSD8: DigitalandPWR (U7.13), Inputs (J1.9)
HSDIN1: DigitalandPWR (U6.3), MCU (U2.32)
HSDIN2: DigitalandPWR (U6.5), MCU (U2.28)
HSDIN3: DigitalandPWR (U6.7), MCU (U2.10)
HSDIN4: DigitalandPWR (U6.9), MCU (U2.8)
HSDIN5: DigitalandPWR (U7.3), MCU (U2.7)
HSDIN6: DigitalandPWR (U7.5), MCU (U2.5)
HSDIN7: DigitalandPWR (U7.7), MCU (U2.4)
HSDIN8: DigitalandPWR (U7.9), MCU (U2.2)
HSDST1/2: DigitalandPWR (U6.4), MCU (U2.29)
HSDST3/4: DigitalandPWR (U6.8), MCU (U2.9)
HSDST5/6: DigitalandPWR (U7.4), MCU (U2.6)
HSDST7/8: DigitalandPWR (U7.8), MCU (U2.3)
I/O1: DigitalandPWR (Q1.2 R3.1), MCU (U2.33)
I/O2: DigitalandPWR (Q2.2 R5.1), MCU (U2.34)
I/O3: DigitalandPWR (Q3.2 R7.1), MCU (U2.35)
I/O4: DigitalandPWR (Q4.2 R9.1), MCU (U2.36)
MISO: DigitalandPWR (U5.9), MCU (U2.12)
MOSI: DigitalandPWR (U5.24), MCU (U2.11)
nCS: DigitalandPWR (U5.22), MCU (U2.37)
SCLK: DigitalandPWR (U5.23), MCU (U2.13)